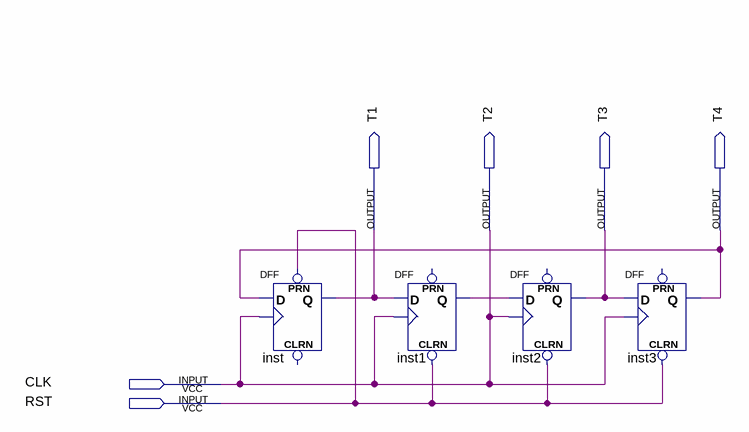
[diagram p0: schematic sheet]
// Quartus schematic test1.bdf as structural Verilog: 4 symbols, 6 pins
module test1 (
  input  CLK,
  input  RST,
  output T1,
  output T2,
  output T3,
  output T4
);

  wire inst1_q;

  DFF inst (.CLK(CLK), .D(T4), .PRN(RST), .Q(T1));  // open: CLRN
  DFF inst1 (.CLRN(RST), .CLK(CLK), .D(T1), .Q(inst1_q));  // open: PRN
  DFF inst2 (.CLRN(RST), .CLK(CLK), .D(inst1_q), .Q(T3));  // open: PRN
  DFF inst3 (.CLRN(RST), .CLK(CLK), .D(T3), .Q(T4));  // open: PRN

  assign T2 = CLK;
endmodule
